# Altium project SVPXFMC_Carrier_6U.PrjPcb (part 2 of 9)

## Sheet FMC_connector.SchDoc
size A2; DocumentNumber: 3; SheetNumber: 3; SheetTotal: 30
Used 2 times, as channels FMC Carrier Channel1/U_FMC_connector, FMC Carrier Channel2/U_FMC_connector. Parts and nets are listed once, with the designators drawn on the sheet.
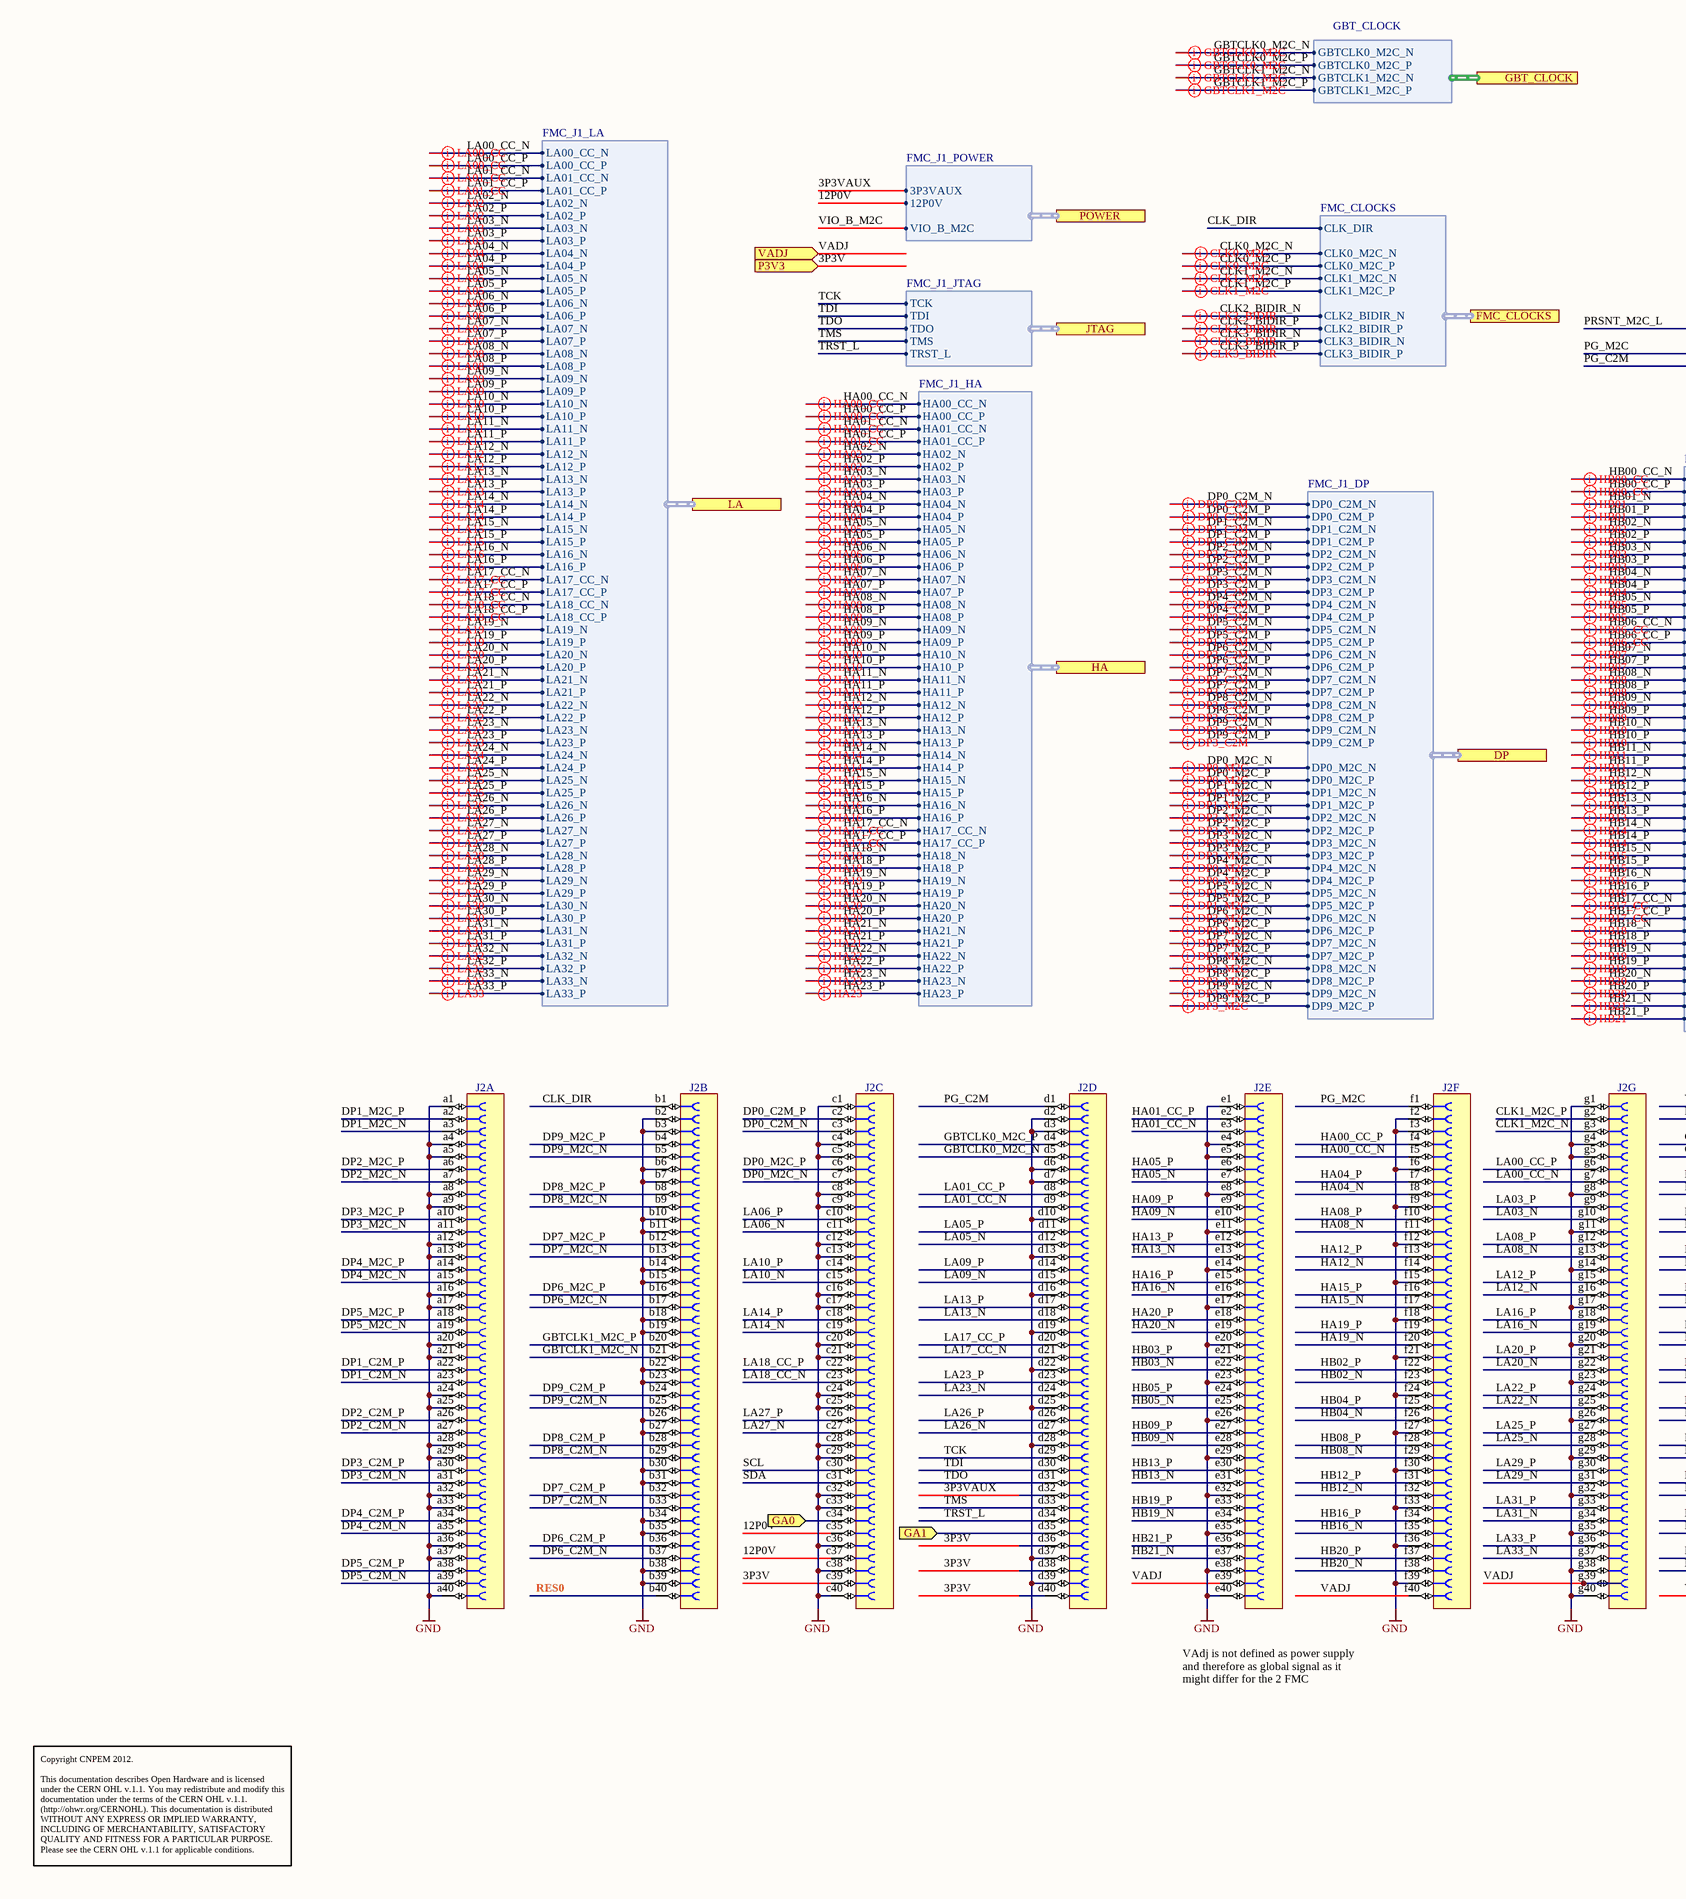
[diagram p4: FMC_connector.SchDoc, left]
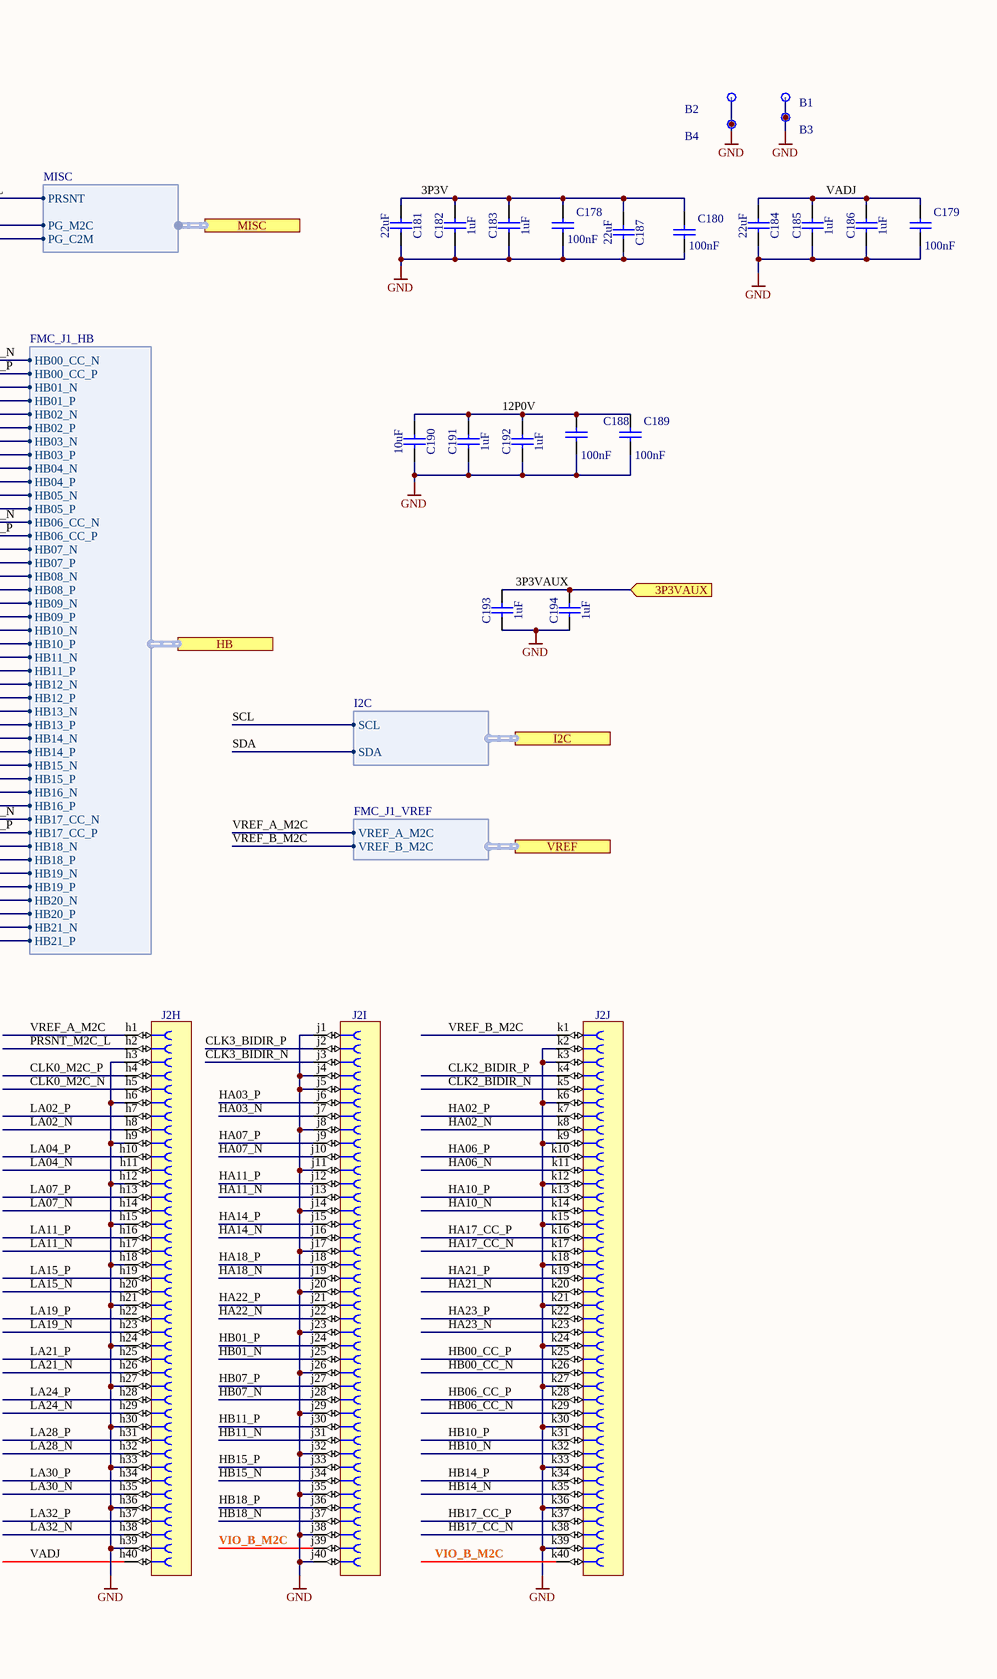
[diagram p5: FMC_connector.SchDoc, right]

### Parts
B1  Plated Hole  [MTG270_500]  (value not drawn)
B2  Plated Hole  [MTG270_500]  (value not drawn)
B3  Plated Hole  [MTG270_500]  (value not drawn)
B4  Plated Hole  [MTG270_500]  (value not drawn)
C178  100nF  [CAPC0603X33N]
C179  100nF  [CAPC0603X33N]
C180  100nF  [CAPC0603X33N]
C181  22uF  [CAPC3216X180N]
C182  1uF  [CAPC1608X87N]
C183  1uF  [CAPC1608X87N]
C184  22uF  [CAPC3216X180N]
C185  1uF  [CAPC1608X87N]
C186  1uF  [CAPC1608X87N]
C187  22uF  [CAPC3216X180N]
C188  100nF  [CAPC0603X33N]
C189  100nF  [CAPC0603X33N]
C190  10uF  [CAPC2012X135N]
C191  1uF  [CAPC1608X87N]
C192  1uF  [CAPC1608X87N]
C193  1uF  [CAPC1608X87N]
C194  1uF  [CAPC1608X87N]
J2  VITA 57  [SAMTEC_ASP-134486-01]  (value not drawn)  (parts A,B,C,D,E,F,G,H,I,J of 10)

### Ports
3P3VAUX (in), DP (harness FMC_J1_DP), FMC_CLOCKS (harness FMC_CLOCKS), GA0 (in), GA1 (in), GBT_CLOCK (harness GBT_CLOCK), HA (harness FMC_J1_HA), HB (harness FMC_J1_HB), I2C (harness I2C), JTAG (harness FMC_J1_JTAG), LA (harness FMC_J1_LA), MISC (harness MISC), P3V3 (in), POWER (harness FMC_J1_POWER), VADJ (in), VREF (harness FMC_J1_VREF)

### Harnesses
FMC_J1_DP: DP1_C2M_N, DP1_C2M_P, DP1_M2C_N, DP1_M2C_P, DP2_C2M_N, DP2_C2M_P, DP2_M2C_N, DP2_M2C_P, DP3_C2M_N, DP3_C2M_P, DP3_M2C_N, DP3_M2C_P, DP0_C2M_N, DP0_C2M_P, DP0_M2C_N, DP0_M2C_P, DP4_C2M_N, DP4_C2M_P, DP5_C2M_N, DP5_C2M_P, DP6_C2M_N, DP6_C2M_P, DP7_C2M_N, DP7_C2M_P, DP8_C2M_N, DP8_C2M_P, DP9_C2M_N, DP9_C2M_P, DP4_M2C_N, DP4_M2C_P, DP5_M2C_N, DP5_M2C_P, DP6_M2C_N, DP6_M2C_P, DP7_M2C_N, DP7_M2C_P, DP8_M2C_N, DP8_M2C_P, DP9_M2C_N, DP9_M2C_P
FMC_J1_LA: LA05_N, LA05_P, LA06_N, LA06_P, LA09_N, LA09_P, LA10_N, LA10_P, LA13_N, LA13_P, LA14_N, LA14_P, LA23_N, LA23_P, LA26_N, LA26_P, LA27_N, LA27_P, LA02_N, LA02_P, LA03_N, LA03_P, LA04_N, LA04_P, LA07_N, LA07_P, LA08_N, LA08_P, LA11_N, LA11_P, LA12_N, LA12_P, LA15_N, LA15_P, LA16_N, LA16_P, LA19_N, LA19_P, LA20_N, LA20_P, LA21_N, LA21_P, LA22_N, LA22_P, LA24_N, LA24_P, LA25_N, LA25_P, LA28_N, LA28_P, LA29_N, LA29_P, LA30_N, LA30_P, LA31_N, LA31_P, LA32_N, LA32_P, LA33_N, LA33_P, LA00_CC_N, LA00_CC_P, LA01_CC_N, LA01_CC_P, LA17_CC_N, LA17_CC_P, LA18_CC_N, LA18_CC_P
FMC_J1_HA: HA04_N, HA04_P, HA05_N, HA05_P, HA08_N, HA08_P, HA09_N, HA09_P, HA12_N, HA12_P, HA13_N, HA13_P, HA15_N, HA15_P, HA16_N, HA16_P, HA19_N, HA19_P, HA20_N, HA20_P, HA02_N, HA02_P, HA03_N, HA03_P, HA06_N, HA06_P, HA07_N, HA07_P, HA10_N, HA10_P, HA11_N, HA11_P, HA14_N, HA14_P, HA18_N, HA18_P, HA21_N, HA21_P, HA22_N, HA22_P, HA23_N, HA23_P, HA17_CC_N, HA17_CC_P, HA00_CC_N, HA00_CC_P, HA01_CC_N, HA01_CC_P
FMC_J1_HB: HB02_N, HB02_P, HB03_N, HB03_P, HB04_N, HB04_P, HB05_N, HB05_P, HB08_N, HB08_P, HB09_N, HB09_P, HB12_N, HB12_P, HB13_N, HB13_P, HB16_N, HB16_P, HB19_N, HB19_P, HB20_N, HB20_P, HB21_N, HB21_P, HB01_N, HB01_P, HB07_N, HB07_P, HB10_N, HB10_P, HB11_N, HB11_P, HB14_N, HB14_P, HB15_N, HB15_P, HB18_N, HB18_P, HB17_CC_N, HB17_CC_P, HB06_CC_N, HB06_CC_P, HB00_CC_N, HB00_CC_P
FMC_J1_POWER: 3P3VAUX, 12P0V, VIO_B_M2C
FMC_J1_JTAG: TCK, TDI, TDO, TMS, TRST_L
I2C: SCL, SDA
FMC_CLOCKS: CLK2_BIDIR_N, CLK2_BIDIR_P, CLK3_BIDIR_N, CLK3_BIDIR_P, CLK0_M2C_N, CLK0_M2C_P, CLK1_M2C_N, CLK1_M2C_P, CLK_DIR
FMC_J1_VREF: VREF_A_M2C, VREF_B_M2C
GBT_CLOCK: GBTCLK0_M2C_N, GBTCLK0_M2C_P, GBTCLK1_M2C_N, GBTCLK1_M2C_P
MISC: PRSNT, PG_M2C, PG_C2M

### Nets
GND: B1.1 B2.1 B3.1 B4.1 C178.1 C179.1 C180.1 C181.2 C182.1 C183.1 C184.2 C185.1 C186.1 C187.2 C188.1 C189.1 C190.2 C191.1 C192.1 C193.1 C194.1 J2.a1 J2.a4 J2.a5 J2.a8 J2.a9 J2.a12 J2.a13 J2.a16 J2.a17 J2.a20 J2.a21 J2.a24 J2.a25 J2.a28 J2.a29 J2.a32 J2.a33 J2.a36 J2.a37 J2.a40 J2.b2 J2.b3 J2.b6 J2.b7 J2.b10 J2.b11 J2.b14 J2.b15 J2.b18 J2.b19 J2.b22 J2.b23 J2.b26 J2.b27 J2.b30 J2.b31 J2.b34 J2.b35 J2.b38 J2.b39 J2.c1 J2.c4 J2.c5 J2.c8 J2.c9 J2.c12 J2.c13 J2.c16 J2.c17 J2.c20 J2.c21 J2.c24 J2.c25 J2.c28 J2.c29 J2.c32 J2.c33 J2.c36 J2.c38 J2.c40 J2.d2 J2.d3 J2.d6 J2.d7 J2.d10 J2.d13 J2.d16 J2.d19 J2.d22 J2.d25 J2.d28 J2.d37 J2.d39 J2.e1 J2.e4 J2.e5 J2.e8 J2.e11 J2.e14 J2.e17 J2.e20 J2.e23 J2.e26 J2.e29 J2.e32 J2.e35 J2.e38 J2.e40 J2.f2 J2.f3 J2.f6 J2.f9 J2.f12 J2.f15 J2.f18 J2.f21 J2.f24 J2.f27 J2.f30 J2.f33 J2.f36 J2.f39 J2.g1 J2.g4 J2.g5 J2.g8 J2.g11 J2.g14 J2.g17 J2.g20 J2.g23 J2.g26 J2.g29 J2.g32 J2.g35 J2.g38 J2.g40 J2.h3 J2.h6 J2.h9 J2.h12 J2.h15 J2.h18 J2.h21 J2.h24 J2.h27 J2.h30 J2.h33 J2.h36 J2.h39 J2.j1 J2.j4 J2.j5 J2.j8 J2.j11 J2.j14 J2.j17 J2.j20 J2.j23 J2.j26 J2.j29 J2.j32 J2.j35 J2.j38 J2.j40 J2.k2 J2.k3 J2.k6 J2.k9 J2.k12 J2.k15 J2.k18 J2.k21 J2.k24 J2.k27 J2.k30 J2.k33 J2.k36 J2.k39
3P3V: C178.2 C180.2 C181.1 C182.2 C183.2 C187.1 J2.c39 J2.d36 J2.d38 J2.d40 ; port P3V3
3P3VAUX: C193.2 C194.2 J2.d32 ; port 3P3VAUX, port POWER.3P3VAUX
12P0V: C188.2 C189.2 C190.1 C191.2 C192.2 J2.c35 J2.c37 ; port POWER.12P0V
CLK0_M2C_N: J2.h5 ; port FMC_CLOCKS.CLK0_M2C_N
CLK0_M2C_P: J2.h4 ; port FMC_CLOCKS.CLK0_M2C_P
CLK1_M2C_N: J2.g3 ; port FMC_CLOCKS.CLK1_M2C_N
CLK1_M2C_P: J2.g2 ; port FMC_CLOCKS.CLK1_M2C_P
CLK2_BIDIR_N: J2.k5 ; port FMC_CLOCKS.CLK2_BIDIR_N
CLK2_BIDIR_P: J2.k4 ; port FMC_CLOCKS.CLK2_BIDIR_P
CLK3_BIDIR_N: J2.j3 ; port FMC_CLOCKS.CLK3_BIDIR_N
CLK3_BIDIR_P: J2.j2 ; port FMC_CLOCKS.CLK3_BIDIR_P
CLK_DIR: J2.b1 ; port FMC_CLOCKS.CLK_DIR
DP0_C2M_N: J2.c3 ; port DP.DP0_C2M_N
DP0_C2M_P: J2.c2 ; port DP.DP0_C2M_P
DP0_M2C_N: J2.c7 ; port DP.DP0_M2C_N
DP0_M2C_P: J2.c6 ; port DP.DP0_M2C_P
DP1_C2M_N: J2.a23 ; port DP.DP1_C2M_N
DP1_C2M_P: J2.a22 ; port DP.DP1_C2M_P
DP1_M2C_N: J2.a3 ; port DP.DP1_M2C_N
DP1_M2C_P: J2.a2 ; port DP.DP1_M2C_P
DP2_C2M_N: J2.a27 ; port DP.DP2_C2M_N
DP2_C2M_P: J2.a26 ; port DP.DP2_C2M_P
DP2_M2C_N: J2.a7 ; port DP.DP2_M2C_N
DP2_M2C_P: J2.a6 ; port DP.DP2_M2C_P
DP3_C2M_N: J2.a31 ; port DP.DP3_C2M_N
DP3_C2M_P: J2.a30 ; port DP.DP3_C2M_P
DP3_M2C_N: J2.a11 ; port DP.DP3_M2C_N
DP3_M2C_P: J2.a10 ; port DP.DP3_M2C_P
DP4_C2M_N: J2.a35 ; port DP.DP4_C2M_N
DP4_C2M_P: J2.a34 ; port DP.DP4_C2M_P
DP4_M2C_N: J2.a15 ; port DP.DP4_M2C_N
DP4_M2C_P: J2.a14 ; port DP.DP4_M2C_P
DP5_C2M_N: J2.a39 ; port DP.DP5_C2M_N
DP5_C2M_P: J2.a38 ; port DP.DP5_C2M_P
DP5_M2C_N: J2.a19 ; port DP.DP5_M2C_N
DP5_M2C_P: J2.a18 ; port DP.DP5_M2C_P
DP6_C2M_N: J2.b37 ; port DP.DP6_C2M_N
DP6_C2M_P: J2.b36 ; port DP.DP6_C2M_P
DP6_M2C_N: J2.b17 ; port DP.DP6_M2C_N
DP6_M2C_P: J2.b16 ; port DP.DP6_M2C_P
DP7_C2M_N: J2.b33 ; port DP.DP7_C2M_N
DP7_C2M_P: J2.b32 ; port DP.DP7_C2M_P
DP7_M2C_N: J2.b13 ; port DP.DP7_M2C_N
DP7_M2C_P: J2.b12 ; port DP.DP7_M2C_P
DP8_C2M_N: J2.b29 ; port DP.DP8_C2M_N
DP8_C2M_P: J2.b28 ; port DP.DP8_C2M_P
DP8_M2C_N: J2.b9 ; port DP.DP8_M2C_N
DP8_M2C_P: J2.b8 ; port DP.DP8_M2C_P
DP9_C2M_N: J2.b25 ; port DP.DP9_C2M_N
DP9_C2M_P: J2.b24 ; port DP.DP9_C2M_P
DP9_M2C_N: J2.b5 ; port DP.DP9_M2C_N
DP9_M2C_P: J2.b4 ; port DP.DP9_M2C_P
GA0: J2.c34 ; port GA0
GA1: J2.d35 ; port GA1
GBTCLK0_M2C_N: J2.d5 ; port GBT_CLOCK.GBTCLK0_M2C_N
GBTCLK0_M2C_P: J2.d4 ; port GBT_CLOCK.GBTCLK0_M2C_P
GBTCLK1_M2C_N: J2.b21 ; port GBT_CLOCK.GBTCLK1_M2C_N
GBTCLK1_M2C_P: J2.b20 ; port GBT_CLOCK.GBTCLK1_M2C_P
HA00_CC_N: J2.f5 ; port HA.HA00_CC_N
HA00_CC_P: J2.f4 ; port HA.HA00_CC_P
HA01_CC_N: J2.e3 ; port HA.HA01_CC_N
HA01_CC_P: J2.e2 ; port HA.HA01_CC_P
HA02_N: J2.k8 ; port HA.HA02_N
HA02_P: J2.k7 ; port HA.HA02_P
HA03_N: J2.j7 ; port HA.HA03_N
HA03_P: J2.j6 ; port HA.HA03_P
HA04_N: J2.f8 ; port HA.HA04_N
HA04_P: J2.f7 ; port HA.HA04_P
HA05_N: J2.e7 ; port HA.HA05_N
HA05_P: J2.e6 ; port HA.HA05_P
HA06_N: J2.k11 ; port HA.HA06_N
HA06_P: J2.k10 ; port HA.HA06_P
HA07_N: J2.j10 ; port HA.HA07_N
HA07_P: J2.j9 ; port HA.HA07_P
HA08_N: J2.f11 ; port HA.HA08_N
HA08_P: J2.f10 ; port HA.HA08_P
HA09_N: J2.e10 ; port HA.HA09_N
HA09_P: J2.e9 ; port HA.HA09_P
HA10_N: J2.k14 ; port HA.HA10_N
HA10_P: J2.k13 ; port HA.HA10_P
HA11_N: J2.j13 ; port HA.HA11_N
HA11_P: J2.j12 ; port HA.HA11_P
HA12_N: J2.f14 ; port HA.HA12_N
HA12_P: J2.f13 ; port HA.HA12_P
HA13_N: J2.e13 ; port HA.HA13_N
HA13_P: J2.e12 ; port HA.HA13_P
HA14_N: J2.j16 ; port HA.HA14_N
HA14_P: J2.j15 ; port HA.HA14_P
HA15_N: J2.f17 ; port HA.HA15_N
HA15_P: J2.f16 ; port HA.HA15_P
HA16_N: J2.e16 ; port HA.HA16_N
HA16_P: J2.e15 ; port HA.HA16_P
HA17_CC_N: J2.k17 ; port HA.HA17_CC_N
HA17_CC_P: J2.k16 ; port HA.HA17_CC_P
HA18_N: J2.j19 ; port HA.HA18_N
HA18_P: J2.j18 ; port HA.HA18_P
HA19_N: J2.f20 ; port HA.HA19_N
HA19_P: J2.f19 ; port HA.HA19_P
HA20_N: J2.e19 ; port HA.HA20_N
HA20_P: J2.e18 ; port HA.HA20_P
HA21_N: J2.k20 ; port HA.HA21_N
HA21_P: J2.k19 ; port HA.HA21_P
HA22_N: J2.j22 ; port HA.HA22_N
HA22_P: J2.j21 ; port HA.HA22_P
HA23_N: J2.k23 ; port HA.HA23_N
HA23_P: J2.k22 ; port HA.HA23_P
HB00_CC_N: J2.k26 ; port HB.HB00_CC_N
HB00_CC_P: J2.k25 ; port HB.HB00_CC_P
HB01_N: J2.j25 ; port HB.HB01_N
HB01_P: J2.j24 ; port HB.HB01_P
HB02_N: J2.f23 ; port HB.HB02_N
HB02_P: J2.f22 ; port HB.HB02_P
HB03_N: J2.e22 ; port HB.HB03_N
HB03_P: J2.e21 ; port HB.HB03_P
HB04_N: J2.f26 ; port HB.HB04_N
HB04_P: J2.f25 ; port HB.HB04_P
HB05_N: J2.e25 ; port HB.HB05_N
HB05_P: J2.e24 ; port HB.HB05_P
HB06_CC_N: J2.k29 ; port HB.HB06_CC_N
HB06_CC_P: J2.k28 ; port HB.HB06_CC_P
HB07_N: J2.j28 ; port HB.HB07_N
HB07_P: J2.j27 ; port HB.HB07_P
HB08_N: J2.f29 ; port HB.HB08_N
HB08_P: J2.f28 ; port HB.HB08_P
HB09_N: J2.e28 ; port HB.HB09_N
HB09_P: J2.e27 ; port HB.HB09_P
HB10_N: J2.k32 ; port HB.HB10_N
HB10_P: J2.k31 ; port HB.HB10_P
HB11_N: J2.j31 ; port HB.HB11_N
HB11_P: J2.j30 ; port HB.HB11_P
HB12_N: J2.f32 ; port HB.HB12_N
HB12_P: J2.f31 ; port HB.HB12_P
HB13_N: J2.e31 ; port HB.HB13_N
HB13_P: J2.e30 ; port HB.HB13_P
HB14_N: J2.k35 ; port HB.HB14_N
HB14_P: J2.k34 ; port HB.HB14_P
HB15_N: J2.j34 ; port HB.HB15_N
HB15_P: J2.j33 ; port HB.HB15_P
HB16_N: J2.f35 ; port HB.HB16_N
HB16_P: J2.f34 ; port HB.HB16_P
HB17_CC_N: J2.k38 ; port HB.HB17_CC_N
HB17_CC_P: J2.k37 ; port HB.HB17_CC_P
HB18_N: J2.j37 ; port HB.HB18_N
HB18_P: J2.j36 ; port HB.HB18_P
HB19_N: J2.e34 ; port HB.HB19_N
HB19_P: J2.e33 ; port HB.HB19_P
HB20_N: J2.f38 ; port HB.HB20_N
HB20_P: J2.f37 ; port HB.HB20_P
HB21_N: J2.e37 ; port HB.HB21_N
HB21_P: J2.e36 ; port HB.HB21_P
LA00_CC_N: J2.g7 ; port LA.LA00_CC_N
LA00_CC_P: J2.g6 ; port LA.LA00_CC_P
LA01_CC_N: J2.d9 ; port LA.LA01_CC_N
LA01_CC_P: J2.d8 ; port LA.LA01_CC_P
LA02_N: J2.h8 ; port LA.LA02_N
LA02_P: J2.h7 ; port LA.LA02_P
LA03_N: J2.g10 ; port LA.LA03_N
LA03_P: J2.g9 ; port LA.LA03_P
LA04_N: J2.h11 ; port LA.LA04_N
LA04_P: J2.h10 ; port LA.LA04_P
LA05_N: J2.d12 ; port LA.LA05_N
LA05_P: J2.d11 ; port LA.LA05_P
LA06_N: J2.c11 ; port LA.LA06_N
LA06_P: J2.c10 ; port LA.LA06_P
LA07_N: J2.h14 ; port LA.LA07_N
LA07_P: J2.h13 ; port LA.LA07_P
LA08_N: J2.g13 ; port LA.LA08_N
LA08_P: J2.g12 ; port LA.LA08_P
LA09_N: J2.d15 ; port LA.LA09_N
LA09_P: J2.d14 ; port LA.LA09_P
LA10_N: J2.c15 ; port LA.LA10_N
LA10_P: J2.c14 ; port LA.LA10_P
LA11_N: J2.h17 ; port LA.LA11_N
LA11_P: J2.h16 ; port LA.LA11_P
LA12_N: J2.g16 ; port LA.LA12_N
LA12_P: J2.g15 ; port LA.LA12_P
LA13_N: J2.d18 ; port LA.LA13_N
LA13_P: J2.d17 ; port LA.LA13_P
LA14_N: J2.c19 ; port LA.LA14_N
LA14_P: J2.c18 ; port LA.LA14_P
LA15_N: J2.h20 ; port LA.LA15_N
LA15_P: J2.h19 ; port LA.LA15_P
LA16_N: J2.g19 ; port LA.LA16_N
LA16_P: J2.g18 ; port LA.LA16_P
LA17_CC_N: J2.d21 ; port LA.LA17_CC_N
LA17_CC_P: J2.d20 ; port LA.LA17_CC_P
LA18_CC_N: J2.c23 ; port LA.LA18_CC_N
LA18_CC_P: J2.c22 ; port LA.LA18_CC_P
LA19_N: J2.h23 ; port LA.LA19_N
LA19_P: J2.h22 ; port LA.LA19_P
LA20_N: J2.g22 ; port LA.LA20_N
LA20_P: J2.g21 ; port LA.LA20_P
LA21_N: J2.h26 ; port LA.LA21_N
LA21_P: J2.h25 ; port LA.LA21_P
LA22_N: J2.g25 ; port LA.LA22_N
LA22_P: J2.g24 ; port LA.LA22_P
LA23_N: J2.d24 ; port LA.LA23_N
LA23_P: J2.d23 ; port LA.LA23_P
LA24_N: J2.h29 ; port LA.LA24_N
LA24_P: J2.h28 ; port LA.LA24_P
LA25_N: J2.g28 ; port LA.LA25_N
LA25_P: J2.g27 ; port LA.LA25_P
LA26_N: J2.d27 ; port LA.LA26_N
LA26_P: J2.d26 ; port LA.LA26_P
LA27_N: J2.c27 ; port LA.LA27_N
LA27_P: J2.c26 ; port LA.LA27_P
LA28_N: J2.h32 ; port LA.LA28_N
LA28_P: J2.h31 ; port LA.LA28_P
LA29_N: J2.g31 ; port LA.LA29_N
LA29_P: J2.g30 ; port LA.LA29_P
LA30_N: J2.h35 ; port LA.LA30_N
LA30_P: J2.h34 ; port LA.LA30_P
LA31_N: J2.g34 ; port LA.LA31_N
LA31_P: J2.g33 ; port LA.LA31_P
LA32_N: J2.h38 ; port LA.LA32_N
LA32_P: J2.h37 ; port LA.LA32_P
LA33_N: J2.g37 ; port LA.LA33_N
LA33_P: J2.g36 ; port LA.LA33_P
PG_C2M: J2.d1 ; port MISC.PG_C2M
PG_M2C: J2.f1 ; port MISC.PG_M2C
PRSNT_M2C_L: J2.h2 ; port MISC.PRSNT
SCL: J2.c30 ; port I2C.SCL
SDA: J2.c31 ; port I2C.SDA
TCK: J2.d29 ; port JTAG.TCK
TDI: J2.d30 ; port JTAG.TDI
TDO: J2.d31 ; port JTAG.TDO
TMS: J2.d33 ; port JTAG.TMS
TRST_L: J2.d34 ; port JTAG.TRST_L
VADJ: C179.2 C184.1 C185.2 C186.2 J2.e39 J2.f40 J2.g39 J2.h40 ; port VADJ
VIO_B_M2C: port POWER.VIO_B_M2C
VREF_A_M2C: J2.h1 ; port VREF.VREF_A_M2C
VREF_B_M2C: J2.k1 ; port VREF.VREF_B_M2C

Not connected (* = marked no-connect by the designer): J2 b40 j39 k40

### Channels
FMC Carrier Channel1/U_FMC_connector: designators end in A; ports 3P3VAUX=3P3VAUX_U_FMC_connector GA0=GND GA1=GND P3V3=3P3V_U_FMC_connector VADJ=VADJ
FMC Carrier Channel2/U_FMC_connector: designators end in B; ports 3P3VAUX=3P3VAUX_U_FMC_connector GA0=GND GA1=GND P3V3=3P3V_U_FMC_connector VADJ=VADJ

### Layout directives
differential pair: CLK0_M2C_N_U_FMC_connector, CLK0_M2C_P_U_FMC_connector, CLK1_M2C_N_U_FMC_connector, CLK1_M2C_P_U_FMC_connector, CLK2_BIDIR_N_U_FMC_connector, CLK2_BIDIR_P_U_FMC_connector, CLK3_BIDIR_N_U_FMC_connector, CLK3_BIDIR_P_U_FMC_connector, DP0_C2M_N, DP0_C2M_P, DP0_M2C_N, DP0_M2C_P, DP1_C2M_N, DP1_C2M_P, DP1_M2C_N, DP1_M2C_P, DP2_C2M_N, DP2_C2M_P, DP2_M2C_N, DP2_M2C_P, DP3_C2M_N, DP3_C2M_P, DP3_M2C_N, DP3_M2C_P, DP4_C2M_N, DP4_C2M_P, DP4_M2C_N, DP4_M2C_P, DP5_C2M_N, DP5_C2M_P, DP5_M2C_N, DP5_M2C_P, DP6_C2M_N, DP6_C2M_P, DP6_M2C_N, DP6_M2C_P, DP7_C2M_N, DP7_C2M_P, DP7_M2C_N, DP7_M2C_P, DP8_C2M_N_U_FMC_connector, DP8_C2M_P_U_FMC_connector, DP8_M2C_N_U_FMC_connector, DP8_M2C_P_U_FMC_connector, DP9_C2M_N_U_FMC_connector, DP9_C2M_P_U_FMC_connector, DP9_M2C_N_U_FMC_connector, DP9_M2C_P_U_FMC_connector, GBTCLK0_M2C_N, GBTCLK0_M2C_P, GBTCLK1_M2C_N, GBTCLK1_M2C_P, HA00_CC_N_U_FMC_connector, HA00_CC_P_U_FMC_connector, HA01_CC_N_U_FMC_connector, HA01_CC_P_U_FMC_connector, HA02_N_U_FMC_connector, HA02_P_U_FMC_connector, HA03_N_U_FMC_connector, HA03_P_U_FMC_connector, HA04_N_U_FMC_connector, HA04_P_U_FMC_connector, HA05_N_U_FMC_connector, HA05_P_U_FMC_connector, HA06_N_U_FMC_connector, HA06_P_U_FMC_connector, HA07_N_U_FMC_connector, HA07_P_U_FMC_connector, HA08_N_U_FMC_connector, HA08_P_U_FMC_connector, HA09_N_U_FMC_connector, HA09_P_U_FMC_connector, HA10_N_U_FMC_connector, HA10_P_U_FMC_connector, HA11_N_U_FMC_connector, HA11_P_U_FMC_connector, HA12_N_U_FMC_connector, HA12_P_U_FMC_connector, HA13_N_U_FMC_connector, HA13_P_U_FMC_connector, HA14_N_U_FMC_connector, HA14_P_U_FMC_connector, HA15_N_U_FMC_connector, HA15_P_U_FMC_connector, HA16_N_U_FMC_connector, HA16_P_U_FMC_connector, HA17_CC_N_U_FMC_connector, HA17_CC_P_U_FMC_connector, HA18_N_U_FMC_connector, HA18_P_U_FMC_connector, HA19_N_U_FMC_connector, HA19_P_U_FMC_connector, HA20_N_U_FMC_connector, HA20_P_U_FMC_connector, HA21_N_U_FMC_connector, HA21_P_U_FMC_connector, HA22_N_U_FMC_connector, HA22_P_U_FMC_connector, HA23_N_U_FMC_connector, HA23_P_U_FMC_connector, HB00_CC_N_U_FMC_connector, HB00_CC_P_U_FMC_connector, HB01_N_U_FMC_connector, HB01_P_U_FMC_connector, HB02_N_U_FMC_connector, HB02_P_U_FMC_connector, HB03_N_U_FMC_connector, HB03_P_U_FMC_connector, HB04_N_U_FMC_connector, HB04_P_U_FMC_connector, HB05_N_U_FMC_connector, HB05_P_U_FMC_connector, HB06_CC_N_U_FMC_connector, HB06_CC_P_U_FMC_connector, HB07_N_U_FMC_connector, HB07_P_U_FMC_connector, HB08_N_U_FMC_connector, HB08_P_U_FMC_connector, HB09_N_U_FMC_connector, HB09_P_U_FMC_connector, HB10_N_U_FMC_connector, HB10_P_U_FMC_connector, HB11_N_U_FMC_connector, HB11_P_U_FMC_connector, HB12_N_U_FMC_connector, HB12_P_U_FMC_connector, HB13_N_U_FMC_connector, HB13_P_U_FMC_connector, HB14_N_U_FMC_connector, HB14_P_U_FMC_connector, HB15_N_U_FMC_connector, HB15_P_U_FMC_connector, HB16_N_U_FMC_connector, HB16_P_U_FMC_connector, HB17_CC_N_U_FMC_connector, HB17_CC_P_U_FMC_connector, HB18_N_U_FMC_connector, HB18_P_U_FMC_connector, HB19_N_U_FMC_connector, HB19_P_U_FMC_connector, HB20_N_U_FMC_connector, HB20_P_U_FMC_connector, HB21_N_U_FMC_connector, HB21_P_U_FMC_connector, LA00_CC_N, LA00_CC_P, LA01_CC_N, LA01_CC_P, LA02_N, LA02_P, LA03_N, LA03_P, LA04_N, LA04_P, LA05_N, LA05_P, LA06_N, LA06_P, LA07_N, LA07_P, LA08_N, LA08_P, LA09_N, LA09_P, LA10_N, LA10_P, LA11_N, LA11_P, LA12_N, LA12_P, LA13_N, LA13_P, LA14_N, LA14_P, LA15_N, LA15_P, LA16_N, LA16_P, LA17_CC_N, LA17_CC_P, LA18_CC_N, LA18_CC_P, LA19_N, LA19_P, LA20_N, LA20_P, LA21_N, LA21_P, LA22_N, LA22_P, LA23_N, LA23_P, LA24_N, LA24_P, LA25_N, LA25_P, LA26_N, LA26_P, LA27_N, LA27_P, LA28_N, LA28_P, LA29_N, LA29_P, LA30_N, LA30_P, LA31_N, LA31_P, LA32_N, LA32_P, LA33_N, LA33_P

### Notes on the sheet
- RES0
- VIO_B_M2C
- VAdj is not defined as power supply and therefore as global signal as it might differ for the 2 FMC mezzanines.
- Copyright CNPEM 2012.
  This documentation describes Open Hardware and is licensed under the CERN OHL v.1.1. You may redistribute and modify this documentation under the terms of the CERN OHL v.1.1. (http://ohwr.org/CERNOHL). This documentation is distributed WITHOUT ANY EXPRESS OR IMPLIED WARRANTY, INCLUDING OF MERCHANTABILITY, SATISFACTORY QUALITY AND FITNESS FOR A PARTICULAR PURPOSE. Please see the CERN OHL v.1.1 for applicable conditions.

### Library data of the parts
B1-B4 = PLATED_HOLE2.7_PAD5.0: Single Terminal Socket; Part Description: Plated Through Hole: Hole Dia.=2.7mm Pad Dia.=5.0mm; Mounted: No; Table: Pads; Part Number: PLATED_HOLE2.7_PAD5.0; Component Kind: Standard (No BOM); Component Type: Standard (No BOM); Pin Count: 1; Family: Plated Hole; Socket: No; SMD: No; Status: None; ComponentHeight: 0mm; Author: CERN DEM JMW; CreateDate: 2011-09-27; LatestRevisionDate: 2011-09-27; PackageDescription: Plated Through Hole: Hole Dia.=2.7mm Pad Dia.=5.0mm
C178-C180 C188 C189 = CC0201_100NF_6.3V_10%_X5R: Non-polarised capacitor; Part Description: SMD Multilayer Chip Ceramic Capacitor; Manufacturer: GENERIC; Manufacturer1 Part Number: 02016D104KAT2A; Voltage: 6.3V; TC: X5R; Tolerance: ±10%; Table: Capacitors SMD; Part Number: CC0201_100NF_6.3V_10%_X5R; Component Kind: Standard; Component Type: Standard; Pin Count: 2; Value: 100nF; Status: Not Recommended; Manufacturer Part Number: CC0201_100NF_6.3V_10%_X5R; Case: 0201; Mounted: Yes; Socket: No; SMD: Yes; Manufacturer1 Example: AVX; Manufacturer1 ComponentHeight: 0.33mm; HelpURL: \\cern.ch\dfs\Applications\Altium\Datasheets\CC0201_X5R_AVX.pdf; Author: CERN DEM JLC; CreateDate: 2007-12-03; LatestRevisionDate: 2007-12-03
C181 C184 C187 = CC1206_22UF_10V_10%_X7R: Non-polarised capacitor; Part Description: SMD Multilayer Chip Ceramic Capacitor; Manufacturer: GENERIC; Manufacturer1 Part Number: GRM31CR71A226KE15L; Voltage: 10V; TC: X7R; Tolerance: ±10%; Table: Capacitors SMD; Part Number: CC1206_22UF_10V_10%_X7R; Component Kind: Standard; Component Type: Standard; Pin Count: 2; Value: 22uF; Status: Preferred; Manufacturer Part Number: CC1206_22UF_10V_10%_X7R; Case: 1206; Mounted: Yes; Socket: No; SMD: Yes; Manufacturer1 Example: MURATA; Manufacturer1 ComponentHeight: 1.8mm; HelpURL: \\cern.ch\dfs\Applications\Altium\Datasheets\CC1206_X7R_MURATA_GRM-HI-CAP.pdf; Author: CERN DEM JLC; CreateDate: 2010-06-08; LatestRevisionDate: 2010-06-08
C182 C183 C185 C186 C191-C194 = CC0603_1UF_25V_10%_X7R: as C239 on sheet LCL; Part Number: CC0603_1UF_25V_10%_X7R; Component Kind: Standard; Component Type: Standard; Pin Count: 2; Value: 1uF; Status: None; Manufacturer Part Number: CC0603_1UF_25V_10%_X7R; Case: 0603; Mounted: Yes; Socket: No; SMD: Yes; Sense: No; Manufacturer1 Example: MURATA; Manufacturer1 ComponentHeight: 0.9mm; HelpURL: \\cern.ch\dfs\Applications\Altium\Datasheets\CC0603_X7R_MURATA.pdf; Author: CERN DEM JLC; CreateDate: 18/01/2011; LatestRevisionDate: 18/01/2011
C190 = CC0805_10UF_16V_10%_X5R: Non-polarised capacitor; Part Description: SMD Multilayer Chip Ceramic Capacitor; Manufacturer: GENERIC; Manufacturer1 Part Number: C0805C106K4PAC; Voltage: 16V; TC: X5R; Tolerance: ±10%; Table: Capacitors SMD; Part Number: CC0805_10UF_16V_10%_X5R; Component Kind: Standard; Component Type: Standard; Pin Count: 2; Value: 10uF; Status: Preferred; Manufacturer Part Number: CC0805_10UF_16V_10%_X5R; Case: 0805; Mounted: Yes; Socket: No; SMD: Yes; Manufacturer1 Example: KEMET; Manufacturer1 ComponentHeight: 1.4mm; HelpURL: \\cern.ch\dfs\Applications\Altium\Datasheets\CC1206_X5R_KEMET.pdf; Author: CERN DEM JLC; CreateDate: 2007-12-03; LatestRevisionDate: 2007-12-03
J2 = SAMTEC_ASP-134486-01: Connector VITA 57, 400 Female contacts in 10 row abcdefghj; Part Description: 400 contacts (10 rows abcdefghj) Surface Mount Female Connector, VITA 57; Manufacturer: SAMTEC; Part Number: SAMTEC_ASP-134486-01; Component Kind: Standard; Component Type: Standard; Pin Count: 400; Family: VITA 57; Mounted: Yes; Socket: No; SMD: Yes; Status: None; Manufacturer Part Number: ASP-134486-01; ComponentHeight: 6.55mm; HelpURL: \\cern.ch\dfs\Applications\Altium\Datasheets\SAMTEC_ASP-134486-01.pdf; Author: CERN DEM JLC; CreateDate: 30/04/2009; LatestRevisionDate: 17/08/2009; Table: SAMTEC

## Sheet FPGA_FMC.SchDoc
size A3
Used 2 times, as channels FMC Carrier Channel1/FPGA_FMC, FMC Carrier Channel2/FPGA_FMC. Parts and nets are listed once, with the designators drawn on the sheet.
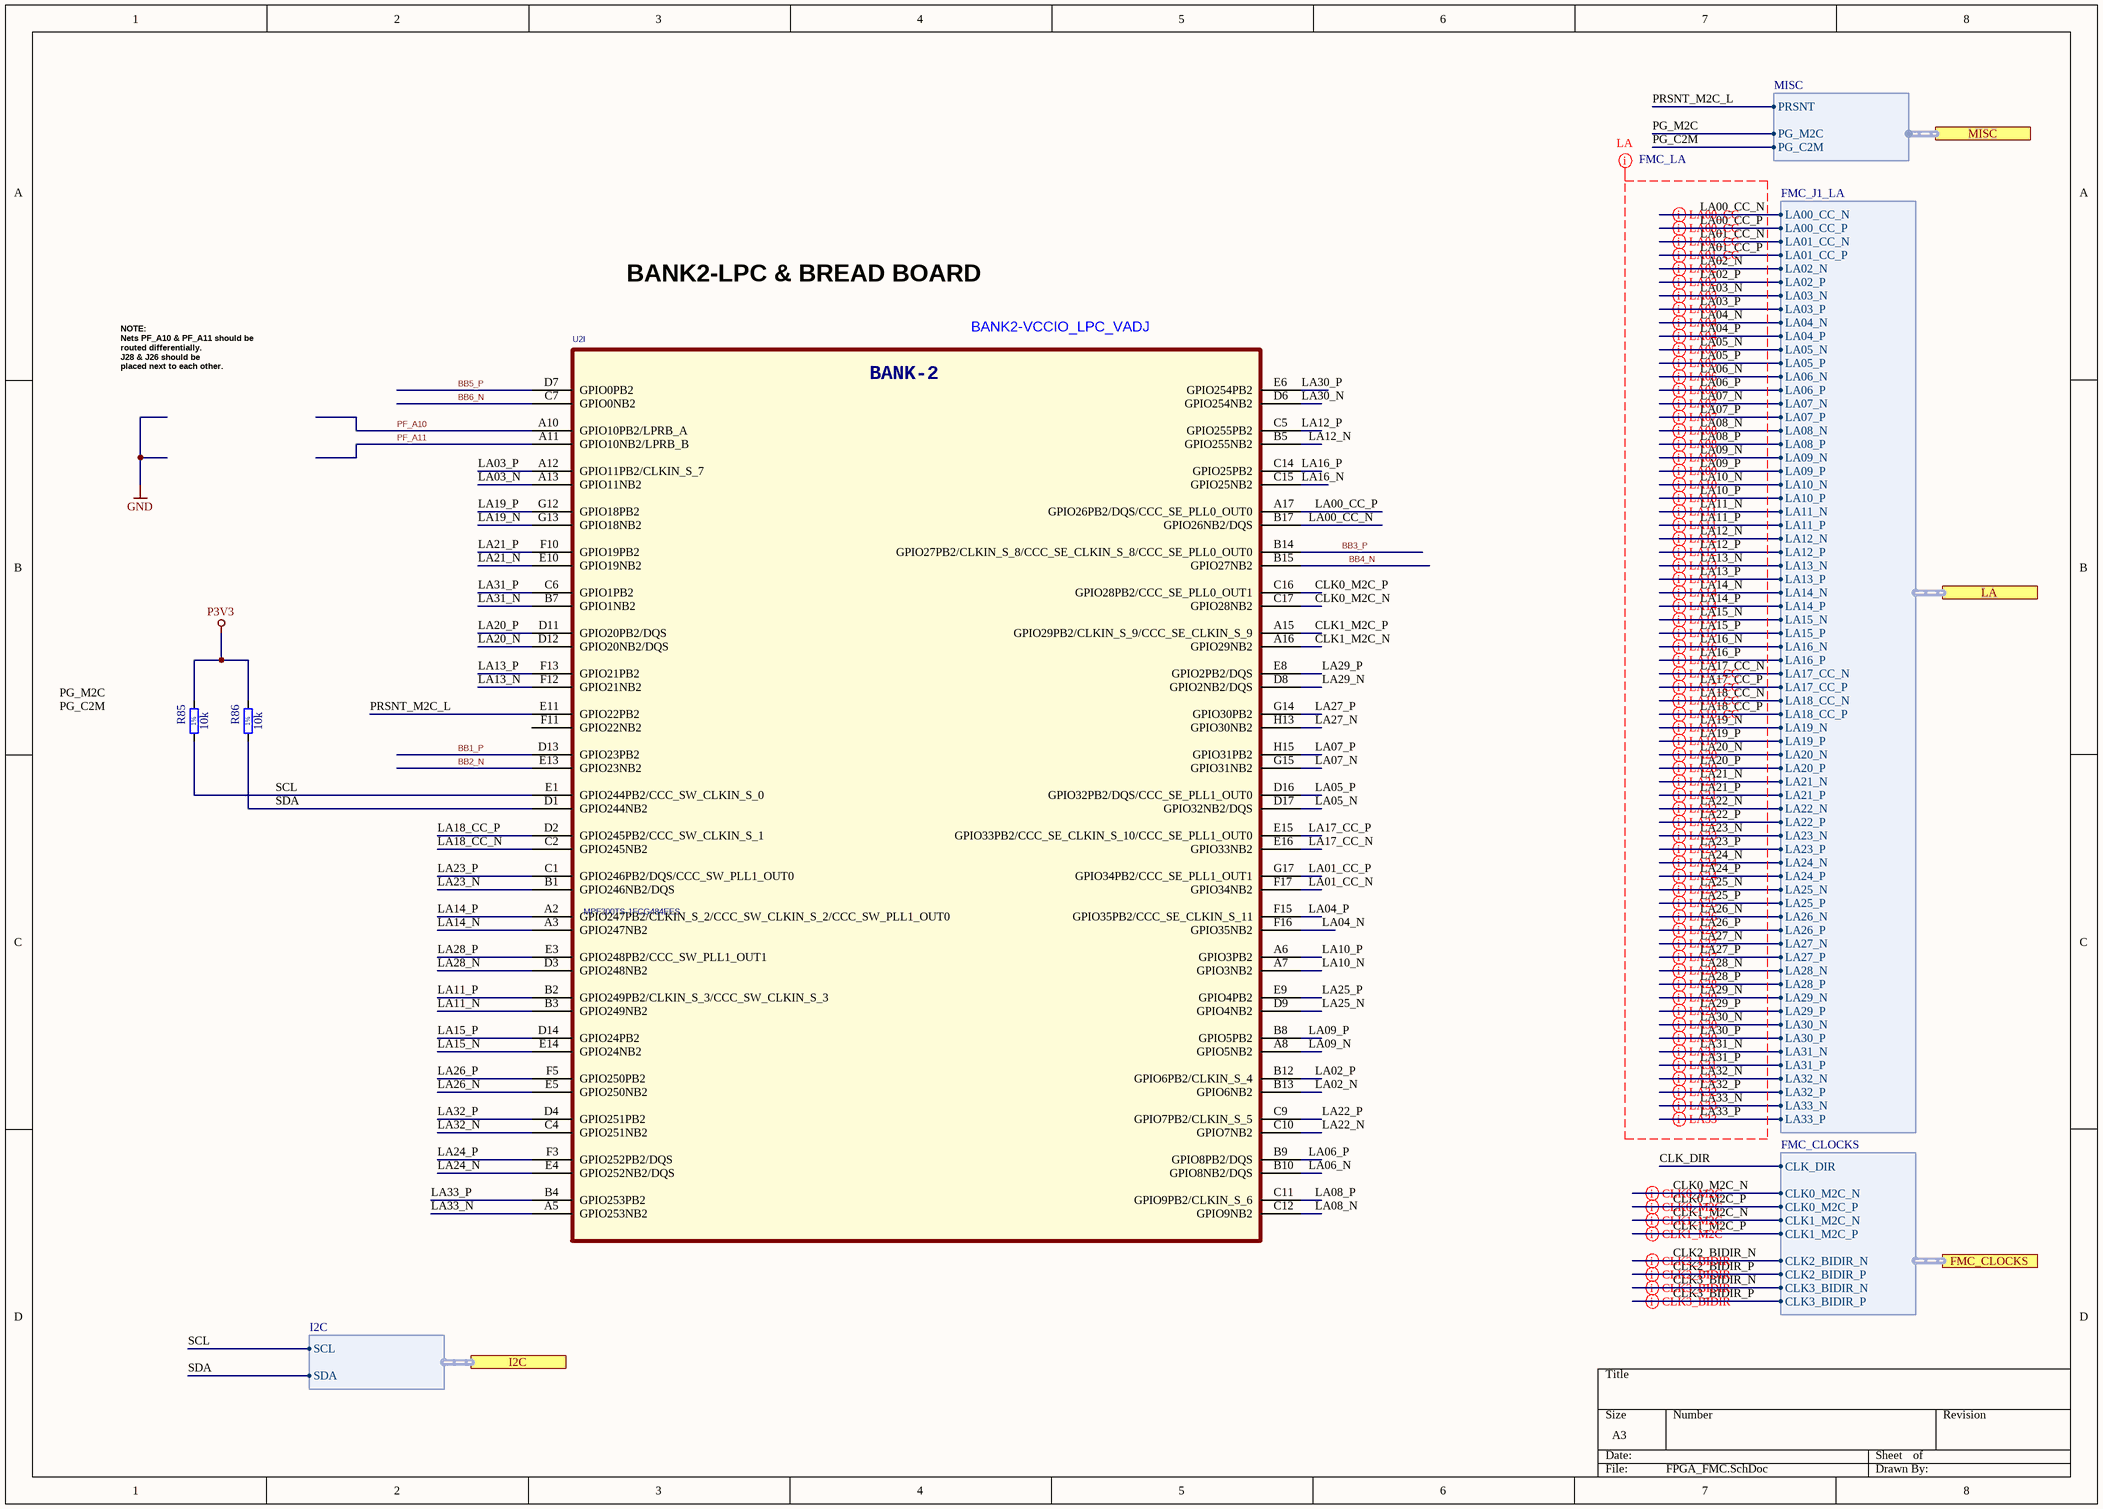
[diagram p6: FPGA_FMC.SchDoc]

### Parts
R85  10k  [RESC1005X40N]
R86  10k  [RESC1005X40N]
U2  MPF300TS-1FCG484EES  [BGA484C100P22X22_2300X2300X320]  (part I of 11)

### Ports
FMC_CLOCKS (harness FMC_CLOCKS), I2C (harness I2C), LA (harness FMC_J1_LA), MISC (harness MISC)

### Harnesses
FMC_J1_LA: LA05_N, LA05_P, LA06_N, LA06_P, LA09_N, LA09_P, LA10_N, LA10_P, LA13_N, LA13_P, LA14_N, LA14_P, LA23_N, LA23_P, LA26_N, LA26_P, LA27_N, LA27_P, LA02_N, LA02_P, LA03_N, LA03_P, LA04_N, LA04_P, LA07_N, LA07_P, LA08_N, LA08_P, LA11_N, LA11_P, LA12_N, LA12_P, LA15_N, LA15_P, LA16_N, LA16_P, LA19_N, LA19_P, LA20_N, LA20_P, LA21_N, LA21_P, LA22_N, LA22_P, LA24_N, LA24_P, LA25_N, LA25_P, LA28_N, LA28_P, LA29_N, LA29_P, LA30_N, LA30_P, LA31_N, LA31_P, LA32_N, LA32_P, LA33_N, LA33_P, LA00_CC_N, LA00_CC_P, LA01_CC_N, LA01_CC_P, LA17_CC_N, LA17_CC_P, LA18_CC_N, LA18_CC_P
FMC_CLOCKS: CLK2_BIDIR_N, CLK2_BIDIR_P, CLK3_BIDIR_N, CLK3_BIDIR_P, CLK0_M2C_N, CLK0_M2C_P, CLK1_M2C_N, CLK1_M2C_P, CLK_DIR
MISC: PRSNT, PG_M2C, PG_C2M
I2C: SCL, SDA

### Nets
P3V3: R85.2 R86.2
BB1_P: U2.D13(GPIO23PB2)
BB2_N: U2.E13(GPIO23NB2)
BB3_P: U2.B14(GPIO27PB2/CLKIN_S_8/CCC_SE_CLKIN_S_8/CCC_SE_PLL0_OUT0)
BB4_N: U2.B15(GPIO27NB2)
BB5_P: U2.D7(GPIO0PB2)
BB6_N: U2.C7(GPIO0NB2)
CLK0_M2C_N: U2.C17(GPIO28NB2) ; port FMC_CLOCKS.CLK0_M2C_N
CLK0_M2C_P: U2.C16(GPIO28PB2/CCC_SE_PLL0_OUT1) ; port FMC_CLOCKS.CLK0_M2C_P
CLK1_M2C_N: U2.A16(GPIO29NB2) ; port FMC_CLOCKS.CLK1_M2C_N
CLK1_M2C_P: U2.A15(GPIO29PB2/CLKIN_S_9/CCC_SE_CLKIN_S_9) ; port FMC_CLOCKS.CLK1_M2C_P
CLK2_BIDIR_N: port FMC_CLOCKS.CLK2_BIDIR_N
CLK2_BIDIR_P: port FMC_CLOCKS.CLK2_BIDIR_P
CLK3_BIDIR_N: port FMC_CLOCKS.CLK3_BIDIR_N
CLK3_BIDIR_P: port FMC_CLOCKS.CLK3_BIDIR_P
CLK_DIR: port FMC_CLOCKS.CLK_DIR
LA00_CC_N: U2.B17(GPIO26NB2/DQS) ; port LA.LA00_CC_N
LA00_CC_P: U2.A17(GPIO26PB2/DQS/CCC_SE_PLL0_OUT0) ; port LA.LA00_CC_P
LA01_CC_N: U2.F17(GPIO34NB2) ; port LA.LA01_CC_N
LA01_CC_P: U2.G17(GPIO34PB2/CCC_SE_PLL1_OUT1) ; port LA.LA01_CC_P
LA02_N: U2.B13(GPIO6NB2) ; port LA.LA02_N
LA02_P: U2.B12(GPIO6PB2/CLKIN_S_4) ; port LA.LA02_P
LA03_N: U2.A13(GPIO11NB2) ; port LA.LA03_N
LA03_P: U2.A12(GPIO11PB2/CLKIN_S_7) ; port LA.LA03_P
LA04_N: U2.F16(GPIO35NB2) ; port LA.LA04_N
LA04_P: U2.F15(GPIO35PB2/CCC_SE_CLKIN_S_11) ; port LA.LA04_P
LA05_N: U2.D17(GPIO32NB2/DQS) ; port LA.LA05_N
LA05_P: U2.D16(GPIO32PB2/DQS/CCC_SE_PLL1_OUT0) ; port LA.LA05_P
LA06_N: U2.B10(GPIO8NB2/DQS) ; port LA.LA06_N
LA06_P: U2.B9(GPIO8PB2/DQS) ; port LA.LA06_P
LA07_N: U2.G15(GPIO31NB2) ; port LA.LA07_N
LA07_P: U2.H15(GPIO31PB2) ; port LA.LA07_P
LA08_N: U2.C12(GPIO9NB2) ; port LA.LA08_N
LA08_P: U2.C11(GPIO9PB2/CLKIN_S_6) ; port LA.LA08_P
LA09_N: U2.A8(GPIO5NB2) ; port LA.LA09_N
LA09_P: U2.B8(GPIO5PB2) ; port LA.LA09_P
LA10_N: U2.A7(GPIO3NB2) ; port LA.LA10_N
LA10_P: U2.A6(GPIO3PB2) ; port LA.LA10_P
LA11_N: U2.B3(GPIO249NB2) ; port LA.LA11_N
LA11_P: U2.B2(GPIO249PB2/CLKIN_S_3/CCC_SW_CLKIN_S_3) ; port LA.LA11_P
LA12_N: U2.B5(GPIO255NB2) ; port LA.LA12_N
LA12_P: U2.C5(GPIO255PB2) ; port LA.LA12_P
LA13_N: U2.F12(GPIO21NB2) ; port LA.LA13_N
LA13_P: U2.F13(GPIO21PB2) ; port LA.LA13_P
LA14_N: U2.A3(GPIO247NB2) ; port LA.LA14_N
LA14_P: U2.A2(GPIO247PB2/CLKIN_S_2/CCC_SW_CLKIN_S_2/CCC_SW_PLL1_OUT0) ; port LA.LA14_P
LA15_N: U2.E14(GPIO24NB2) ; port LA.LA15_N
LA15_P: U2.D14(GPIO24PB2) ; port LA.LA15_P
LA16_N: U2.C15(GPIO25NB2) ; port LA.LA16_N
LA16_P: U2.C14(GPIO25PB2) ; port LA.LA16_P
LA17_CC_N: U2.E16(GPIO33NB2) ; port LA.LA17_CC_N
LA17_CC_P: U2.E15(GPIO33PB2/CCC_SE_CLKIN_S_10/CCC_SE_PLL1_OUT0) ; port LA.LA17_CC_P
LA18_CC_N: U2.C2(GPIO245NB2) ; port LA.LA18_CC_N
LA18_CC_P: U2.D2(GPIO245PB2/CCC_SW_CLKIN_S_1) ; port LA.LA18_CC_P
LA19_N: U2.G13(GPIO18NB2) ; port LA.LA19_N
LA19_P: U2.G12(GPIO18PB2) ; port LA.LA19_P
LA20_N: U2.D12(GPIO20NB2/DQS) ; port LA.LA20_N
LA20_P: U2.D11(GPIO20PB2/DQS) ; port LA.LA20_P
LA21_N: U2.E10(GPIO19NB2) ; port LA.LA21_N
LA21_P: U2.F10(GPIO19PB2) ; port LA.LA21_P
LA22_N: U2.C10(GPIO7NB2) ; port LA.LA22_N
LA22_P: U2.C9(GPIO7PB2/CLKIN_S_5) ; port LA.LA22_P
LA23_N: U2.B1(GPIO246NB2/DQS) ; port LA.LA23_N
LA23_P: U2.C1(GPIO246PB2/DQS/CCC_SW_PLL1_OUT0) ; port LA.LA23_P
LA24_N: U2.E4(GPIO252NB2/DQS) ; port LA.LA24_N
LA24_P: U2.F3(GPIO252PB2/DQS) ; port LA.LA24_P
LA25_N: U2.D9(GPIO4NB2) ; port LA.LA25_N
LA25_P: U2.E9(GPIO4PB2) ; port LA.LA25_P
LA26_N: U2.E5(GPIO250NB2) ; port LA.LA26_N
LA26_P: U2.F5(GPIO250PB2) ; port LA.LA26_P
LA27_N: U2.H13(GPIO30NB2) ; port LA.LA27_N
LA27_P: U2.G14(GPIO30PB2) ; port LA.LA27_P
LA28_N: U2.D3(GPIO248NB2) ; port LA.LA28_N
LA28_P: U2.E3(GPIO248PB2/CCC_SW_PLL1_OUT1) ; port LA.LA28_P
LA29_N: U2.D8(GPIO2NB2/DQS) ; port LA.LA29_N
LA29_P: U2.E8(GPIO2PB2/DQS) ; port LA.LA29_P
LA30_N: U2.D6(GPIO254NB2) ; port LA.LA30_N
LA30_P: U2.E6(GPIO254PB2) ; port LA.LA30_P
LA31_N: U2.B7(GPIO1NB2) ; port LA.LA31_N
LA31_P: U2.C6(GPIO1PB2) ; port LA.LA31_P
LA32_N: U2.C4(GPIO251NB2) ; port LA.LA32_N
LA32_P: U2.D4(GPIO251PB2) ; port LA.LA32_P
LA33_N: U2.A5(GPIO253NB2) ; port LA.LA33_N
LA33_P: U2.B4(GPIO253PB2) ; port LA.LA33_P
PF_A10: U2.A10(GPIO10PB2/LPRB_A)
PF_A11: U2.A11(GPIO10NB2/LPRB_B)
PG_C2M: port MISC.PG_C2M
PG_M2C: port MISC.PG_M2C
PRSNT_M2C_L: U2.E11(GPIO22PB2) ; port MISC.PRSNT
SCL: R85.1 U2.E1(GPIO244PB2/CCC_SW_CLKIN_S_0) ; port I2C.SCL
SDA: R86.1 U2.D1(GPIO244NB2) ; port I2C.SDA

Not connected (* = marked no-connect by the designer): U2 F11(GPIO22NB2)

### Channels
FMC Carrier Channel1/FPGA_FMC: designators R85=R85A R86=R86A U2=U2A#1
FMC Carrier Channel2/FPGA_FMC: designators R85=R85B R86=R86B U2=U2B#1

### Layout directives
differential pair: CLK0_M2C_N_FPGA_FMC, CLK0_M2C_P_FPGA_FMC, CLK1_M2C_N_FPGA_FMC, CLK1_M2C_P_FPGA_FMC, CLK2_BIDIR_N_FPGA_FMC, CLK2_BIDIR_P_FPGA_FMC, CLK3_BIDIR_N_FPGA_FMC, CLK3_BIDIR_P_FPGA_FMC, LA00_CC_N, LA00_CC_P, LA01_CC_N, LA01_CC_P, LA02_N, LA02_P, LA03_N, LA03_P, LA04_N, LA04_P, LA05_N, LA05_P, LA06_N, LA06_P, LA07_N, LA07_P, LA08_N, LA08_P, LA09_N, LA09_P, LA10_N, LA10_P, LA11_N, LA11_P, LA12_N, LA12_P, LA13_N, LA13_P, LA14_N, LA14_P, LA15_N, LA15_P, LA16_N, LA16_P, LA17_CC_N, LA17_CC_P, LA18_CC_N, LA18_CC_P, LA19_N, LA19_P, LA20_N, LA20_P, LA21_N, LA21_P, LA22_N, LA22_P, LA23_N, LA23_P, LA24_N, LA24_P, LA25_N, LA25_P, LA26_N, LA26_P, LA27_N, LA27_P, LA28_N, LA28_P, LA29_N, LA29_P, LA30_N, LA30_P, LA31_N, LA31_P, LA32_N, LA32_P, LA33_N, LA33_P
net class FMC_LA: LA00_CC_N, LA00_CC_P, LA01_CC_N, LA01_CC_P, LA02_N, LA02_P, LA03_N, LA03_P, LA04_N, LA04_P, LA05_N, LA05_P, LA06_N, LA06_P, LA07_N, LA07_P, LA08_N, LA08_P, LA09_N, LA09_P, LA10_N, LA10_P, LA11_N, LA11_P, LA12_N, LA12_P, LA13_N, LA13_P, LA14_N, LA14_P, LA15_N, LA15_P, LA16_N, LA16_P, LA17_CC_N, LA17_CC_P, LA18_CC_N, LA18_CC_P, LA19_N, LA19_P, LA20_N, LA20_P, LA21_N, LA21_P, LA22_N, LA22_P, LA23_N, LA23_P, LA24_N, LA24_P, LA25_N, LA25_P, LA26_N, LA26_P, LA27_N, LA27_P, LA28_N, LA28_P, LA29_N, LA29_P, LA30_N, LA30_P, LA31_N, LA31_P, LA32_N, LA32_P, LA33_N, LA33_P

### Notes on the sheet
- BANK2-LPC & BREAD BOARD
- NOTE:
  Nets PF_A10 & PF_A11 should be
  routed differentially.
  J28 & J26 should be
  placed next to each other.
- BANK2-VCCIO_LPC_VADJ
- Labels drawn without touching a wire or pin: PG_C2M, PG_M2C
- (in symbol FPGA_MPF300T-FCG484, part I) BANK-2
- (in symbol R0402_10K_1%_0.0625W_100PPM) 1%

### Library data of the parts
R85 R86 = R0402_10K_1%_0.0625W_100PPM: Resistor - 1%; Manufacturer: GENERIC; Part Description: General Purpose Thick Film Chip Resistor; Manufacturer1 Part Number: 232270671003L; TC: ±100ppm/°C; PressFit: No; Manufacturer Part Number: R0402_10K_1%_0.0625W_100PPM; Part Number: R0402_10K_1%_0.0625W_100PPM; Tolerance: ±1%; Value: 10k; Component Kind: Standard; Component Type: Standard; Pin Count: 2; Status: Not Recommended; Power: 0.0625W; Case: 0402; Mounted: Yes; Sense: No; Socket: No; SMD: Yes; Manufacturer1 Example: YAGEO PHYCOMP; Manufacturer1 ComponentHeight: 0.4mm; HelpURL: \\cern.ch\dfs\Applications\Altium\Datasheets\R0402_Phycomp_RC0402.pdf; Author: CERN DEM JLC; CreateDate: 03/12/2007; LatestRevisionDate: 17/10/2012
U2 = FPGA_MPF300T-FCG484: FCG484,23mmX23mm,1.0mm pitch; Manufacturer: Microsemi; Part Number: MPF300TS-1FCG484I